# EAGLE design (go)(error)(forward) (EAGLE 7.5.0)
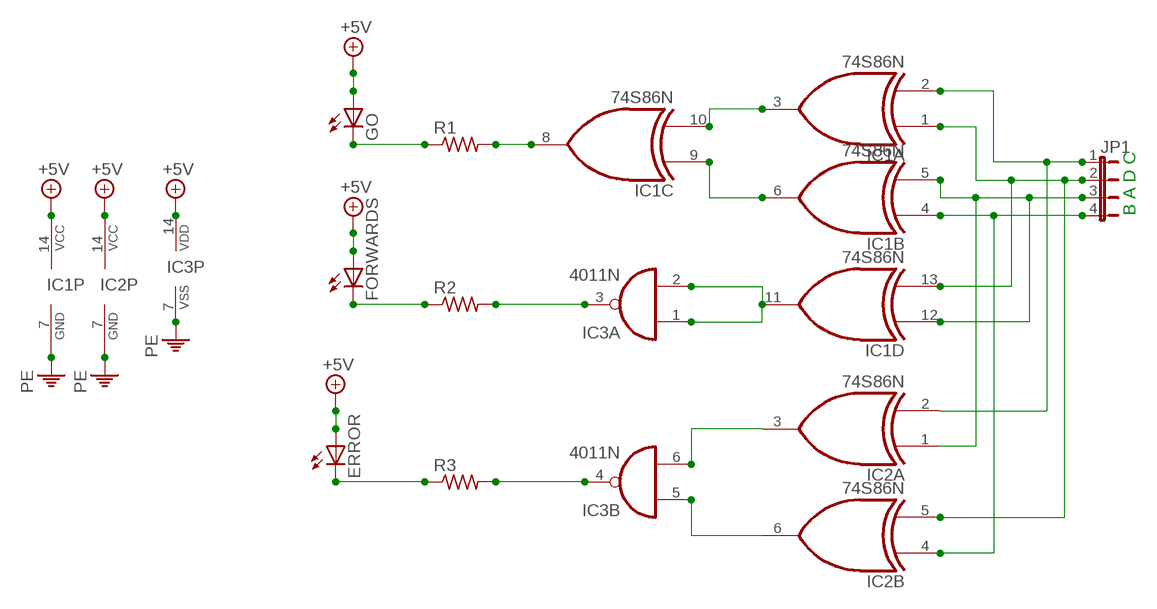
[diagram p0: schematic, sheet 1]

## Parts
ERROR  LED5MM  [LED5MM]
FORWARDS  LED5MM  [LED5MM]
GO  LED5MM  [LED5MM]
IC1  74S86N  [DIL14]
IC2  74S86N  [DIL14]
IC3  4011N  [DIL14]
JP1  JP4E  [JP4]
R1  R-US_0207/10  [0207/10]
R2  R-US_0207/10  [0207/10]
R3  R-US_0207/10  [0207/10]

## Nets
+5V: ERROR.A FORWARDS.A GO.A IC1.14(P:VCC) IC2.14(P:VCC) IC3.14(P:VDD)
N$1: IC1.2(A:I1) IC2.2(A:I1) JP1.1
N$2: IC2.3(A:O) IC3.6(B:I1)
N$3: IC1.5(B:I1) IC1.12(D:I0) IC2.1(A:I0) JP1.3
N$4: IC1.4(B:I0) IC2.4(B:I0) JP1.4
N$5: IC2.6(B:O) IC3.5(B:I0)
N$6: IC3.3(A:O) R2.2
N$7: IC1.3(A:O) IC1.10(C:I1)
N$8: IC1.6(B:O) IC1.9(C:I0)
N$9: IC1.1(A:I0) IC1.13(D:I1) IC2.5(B:I1) JP1.2
N$10: IC1.8(C:O) R1.2
N$11: IC3.4(B:O) R3.2
N$12: GO.K(C) R1.1
N$13: FORWARDS.K(C) R2.1
N$14: IC1.11(D:O) IC3.1(A:I0) IC3.2(A:I1)
N$15: ERROR.K(C) R3.1
PE: IC1.7(P:GND) IC2.7(P:GND) IC3.7(P:VSS)
Unconnected: IC2.8(C:O) IC2.9(C:I0) IC2.10(C:I1) IC2.11(D:O) IC2.12(D:I0) IC2.13(D:I1) IC3.8(C:I0) IC3.9(C:I1) IC3.10(C:O) IC3.11(D:O) IC3.12(D:I0) IC3.13(D:I1)

## Notes on the sheet
- B A D C

## Library data of the parts
ERROR FORWARDS GO = led:LED: LED OSRAM: - CHIPLED LG R971, LG N971, LY N971, LG Q971, LY Q971, LO R971, LY R971 LH N974, LH R974 LS Q976, LO Q976, LY Q976 LO Q996 - Hyper CHIPLED LW Q18S LB Q993, LB Q99A, LB R99A - SideLED LS A670, LO A670, LY A670, LG A670, LP A670 LB A673, LV A673, LT A673, LW A673 LH A674 LY A675 LS A676, LA A676, LO A676, LY A676, LW A676 LS A679, LY A679, LG A679 - Hyper Micro SIDELED® LS Y876, LA Y876, LO Y876, LY Y876 LT Y87S - SmartLED LW L88C, LW L88S LB L89C, LB L89S, LG L890 LS L89K, LO L89K, LY L89K LS L896, LA L896, LO L896, LY L896 - TOPLED LS T670, LO T670, LY T670, LG T670, LP T670 LSG T670, LSP T670, LSY T670, LOP T670, LYG T670 LG T671, LOG T671, LSG T671 LB T673, LV T673, LT T673, LW T673 LH T674 LS T676, LA T676, LO T676, LY T676, LB T676, LH T676, LSB T676, LW T676 LB T67C, LV T67C, LT T67C, LS T67K, LO T67K, LY T67K, LW E67C LS E67B, LA E67B, LO E67B, LY E67B, LB E67C, LV E67C, LT E67C LW T67C LS T679, LY T679, LG T679 LS T770, LO T770, LY T770, LG T770, LP T770 LB T773, LV T773, LT T773, LW T773 LH T774 LS E675, LA E675, LY E675, LS T675 LS T776, LA T776, LO T776, LY T776, LB T776 LHGB T686 LT T68C, LB T68C - Hyper Mini TOPLED® LB M676 - Mini TOPLED Santana® LG M470 LS M47K, LO M47K, LY M47K Source: http://www.osram.convergy.de LUXEON: - LUMILED® LXK2-PW12-R00, LXK2-PW12-S00, LXK2-PW14-U00, LXK2-PW14-V00 LXK2-PM12-R00, LXK2-PM12-S00, LXK2-PM14-U00 LXK2-PE12-Q00, LXK2-PE12-R00, LXK2-PE12-S00, LXK2-PE14-T00, LXK2-PE14-U00 LXK2-PB12-K00, LXK2-PB12-L00, LXK2-PB12-M00, LXK2-PB14-N00, LXK2-PB14-P00, LXK2-PB14-Q00 LXK2-PR12-L00, LXK2-PR12-M00, LXK2-PR14-Q00, LXK2-PR14-R00 LXK2-PD12-Q00, LXK2-PD12-R00, LXK2-PD12-S00 LXK2-PH12-R00, LXK2-PH12-S00 LXK2-PL12-P00, LXK2-PL12-Q00, LXK2-PL12-R00 Source: www.luxeon.com KINGBRIGHT: KA-3528ASYC Source: www.kingbright.com
IC1 IC2 = 74xx-us:74*86: Quad 2-input EXCLUSIV-OR (XOR) gate
IC3 = 40xx:4011: Quad 2-input NAND
JP1 = jumper:JP4E: JUMPER
R1-R3 = rcl:R-US_: RESISTOR, American symbol

## Board
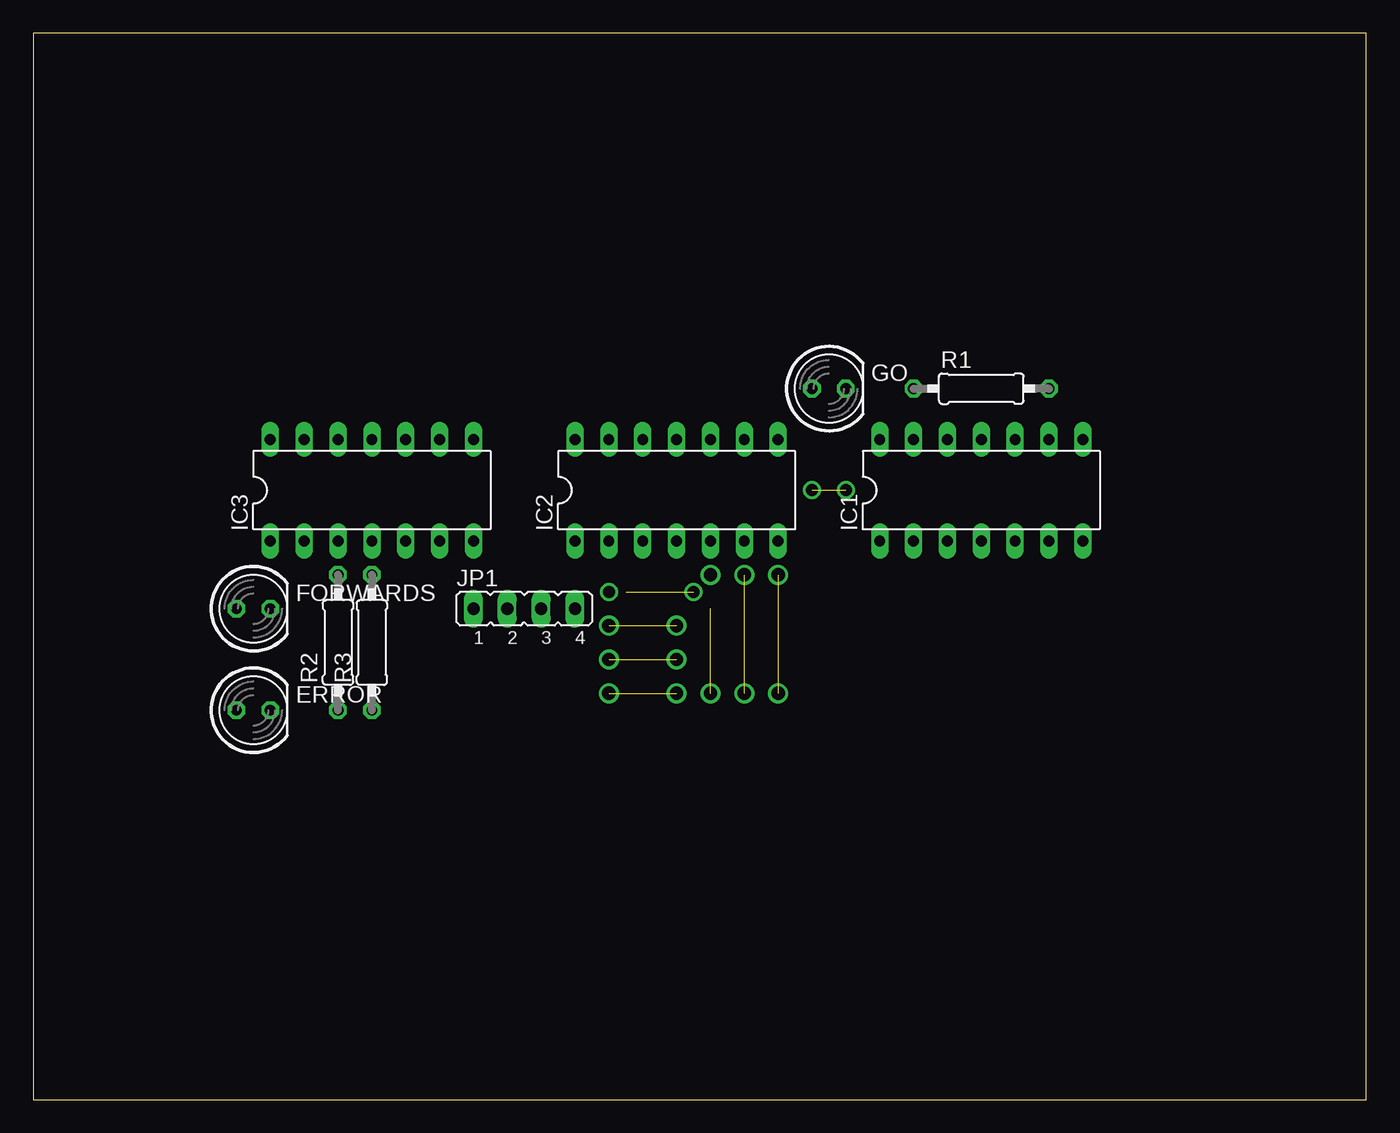
[diagram p1: board, top side]
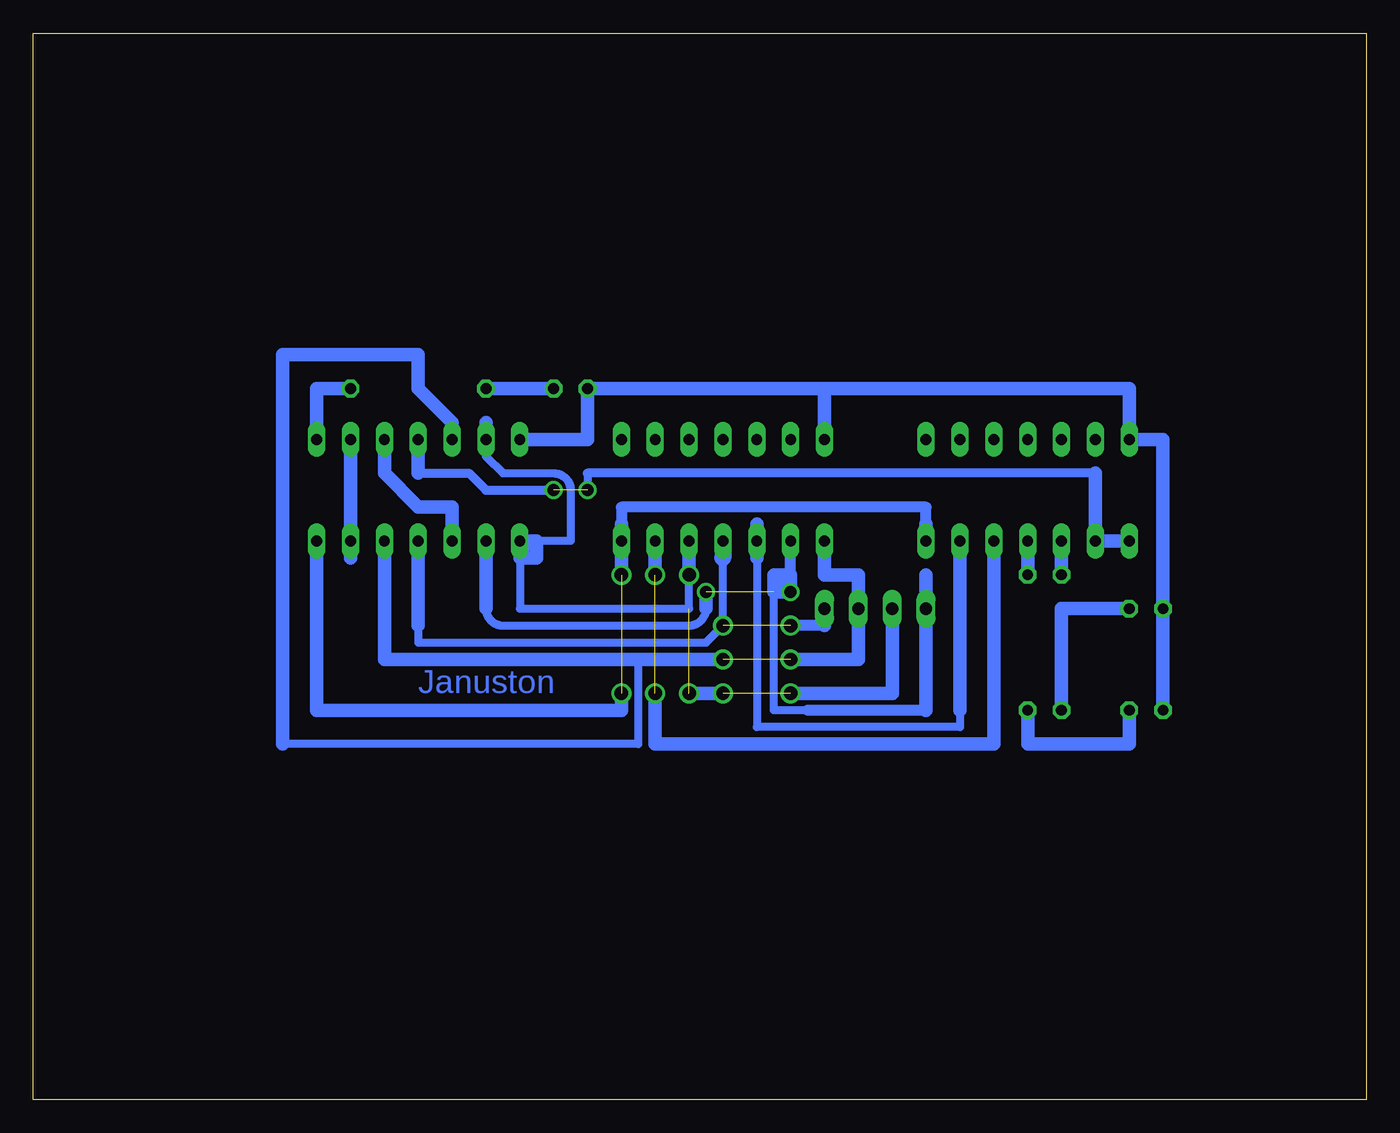
[diagram p2: board, bottom side, seen from below]

Size 100 x 80 mm. Coordinates in mm from the lower left corner, seen from the top.
Outline: 0,0 100,0 100,80 0,80 0,0
Copper layers (1*16): Top 0.035mm / dielectric 1.5mm / Bottom 0.035mm
Design rules "default": minimum track width 10mil, minimum drill 24mil, track to track 8mil, track to pad 8mil, pad to pad 8mil, via to via 8mil, smd to smd 8mil, copper to edge 40mil, drill to drill 8mil, minimum pad ring 10mil, minimum via ring 8mil, stop-mask expansion 4mil, vias tented up to drill 0mil, thermal gap 10mil

### Footprints (pad centres in the part's own frame; a part is rotated, then mirrored left to right if it is on the bottom)
LED5MM = drill 0.813 octagon: A -1.27,0; K 1.27,0
DIL14 = drill 0.813 long: 1 -7.62,-3.81; 2 -5.08,-3.81; 3 -2.54,-3.81; 4 0,-3.81; 5 2.54,-3.81; 6 5.08,-3.81; 7 7.62,-3.81; 8 7.62,3.81; 9 5.08,3.81; 10 2.54,3.81; 11 0,3.81; 12 -2.54,3.81; 13 -5.08,3.81; 14 -7.62,3.81
JP4 = drill 0.914 long: 1 -3.81,0; 2 -1.27,0; 3 1.27,0; 4 3.81,0
0207/10 = drill 0.813 octagon: 1 -5.08,0; 2 5.08,0

### Placement (x,y rotation side)
ERROR  16.51,29.21 0 top
FORWARDS  16.51,36.83 0 top
GO  59.69,53.34 0 top
IC1  71.12,45.72 0 top
IC2  48.26,45.72 0 top
IC3  25.4,45.72 0 top
JP1  36.83,36.83 0 top
R1  71.12,53.34 0 top
R2  22.86,34.29 90 top
R3  25.4,34.29 90 top

### Tracks (layer width: path | path; a pad name or v marks a point on that pad's centre or on a via)
+5V
  Bottom 1.016: 40.64,53.34 17.78,53.34 IC3.14 15.24,49.53 FORWARDS.A ERROR.A | IC2.14 40.64,53.34 | IC1.14 58.42,49.53 GO.A 40.64,53.34
N$1  (1 unrouted)
  Bottom 0.61: 41.91,29.21 44.45,29.21 44.45,38.1 | 66.04,36.83 arc-90 64.77,35.56 50.8,35.56 arc-90 49.53,36.83
  Bottom 0.813: 43.18,39.37 IC2.2 | 33.02,29.21 41.91,29.21
  Bottom 1.016: 33.02,39.37 JP1.1 33.02,29.21 | IC1.2 66.04,36.83 | 49.53,36.83 49.53,38.1 | 43.18,38.1 43.18,39.37 44.45,39.37 | 44.45,39.37 44.45,38.1 43.18,38.1 | 43.18,38.1 44.45,39.37
N$2
  Bottom 0.61: 30.48,29.21 30.48,27.94 45.72,27.94 45.72,40.64
  Bottom 1.016: IC3.6 30.48,29.21 | 45.72,43.18 IC2.3 45.72,40.64
N$3  (via drill 1)  (1 unrouted)
  Bottom 0.61: 54.61,33.02 54.61,26.67 81.28,26.67
  Bottom 1.016: IC1.12 68.58,50.8 71.12,53.34 71.12,55.88 81.28,55.88 81.28,26.67 | v48.26,33.02 54.61,33.02 73.66,33.02 IC1.5 | IC2.1 40.64,39.37 38.1,39.37 JP1.3 38.1,33.02 v43.18,33.02
N$4  (via drill 1)  (1 unrouted)
  Bottom 0.61: 71.12,35.56 71.12,34.29 49.53,34.29 v48.26,35.56 IC2.4
  Bottom 0.813: 40.64,35.56 v43.18,35.56
  Bottom 1.016: IC1.4 71.12,35.56 | JP1.4 40.64,35.56
  Bottom 1.27: IC2.4 48.26,40.64
N$5  (via drill 1)  (1 unrouted)
  Bottom 1.016: IC3.5 27.94,26.67 53.34,26.67 v53.34,30.48 | IC2.6 53.34,39.37
N$6
  Bottom 1.016: R2.2 IC3.3
N$7
  Bottom 1.016: IC1.3 68.58,44.45 71.12,44.45 73.66,46.99 IC1.10
N$8
  Bottom 1.016: IC1.9 IC1.6 76.2,40.64
N$9  (via drill 1)  (2 unrouted)
  Bottom 0.61: 66.04,50.8 66.04,48.26 64.77,46.99 60.96,46.99 arc90 59.69,45.72 59.69,41.91 62.23,41.91 | IC1.1 arc90 62.23,40.64 | 63.5,40.64 63.5,36.83 50.8,36.83 v50.8,39.37
  Bottom 1.016: IC2.5 v50.8,39.37 | JP1.2 35.56,30.48 v43.18,30.48 | v50.8,30.48 v48.26,30.48 | IC1.13 66.04,50.8 | 63.5,40.64 62.23,40.64 62.23,41.91 | 62.23,41.91 arc-90 63.5,40.64 | 63.5,40.64 IC1.1 62.23,41.91
N$10
  Bottom 1.016: R1.2 78.74,53.34 IC1.8
N$11
  Bottom 1.016: R3.2 IC3.4
N$12
  Bottom 1.016: R1.1 GO.K
N$13
  Bottom 1.016: R2.1 22.86,36.83 FORWARDS.K
N$14  (via drill 0.9)  (1 unrouted)
  Bottom 0.61: 58.42,46.99 v58.42,45.72
  Bottom 0.66: 20.32,46.99 58.42,46.99 | 71.12,46.99 67.31,46.99 66.04,45.72 v60.96,45.72
  Bottom 1.016: IC3.1 IC3.2 20.32,46.99 | 71.12,46.99 IC1.11
N$15
  Bottom 1.016: ERROR.K 17.78,26.67 25.4,26.67 R3.1
N$16  (via drill 1)
  other vias: 53.34,39.37
N$17  (via drill 1)
  other vias: 55.88,39.37
N$18  (via drill 0.9)
  other vias: 43.18,38.1
N$19  (via drill 0.9)
  other vias: 49.53,38.1
PE  (via drill 1)  (1 unrouted)
  Bottom 0.813: IC3.7 33.02,44.45 55.88,44.45 55.88,43.18
  Bottom 1.016: IC1.7 78.74,29.21 55.88,29.21 v55.88,30.48 | IC3.7 33.02,43.18 | 55.88,43.18 IC2.7 55.88,39.37

### Text on the board
Bottom: Januston